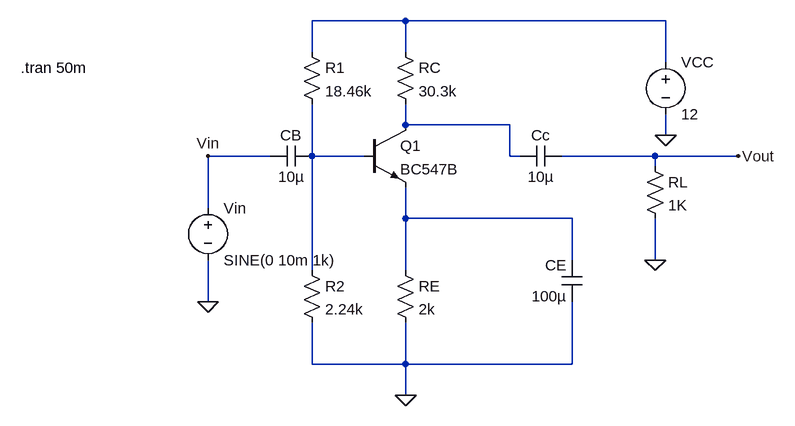
[diagram p0: schematic 4general.asc]
4general.asc, the LTspice schematic file:
Version 4
SHEET 1 880 680
WIRE 240 16 96 16
WIRE 640 16 240 16
WIRE 96 64 96 16
WIRE 240 64 240 16
WIRE 640 80 640 16
WIRE 240 176 240 144
WIRE 400 176 240 176
WIRE 640 192 640 160
WIRE 32 224 -64 224
WIRE 96 224 96 144
WIRE 176 224 96 224
WIRE 400 224 400 176
WIRE 416 224 400 224
WIRE 624 224 480 224
WIRE 752 224 624 224
WIRE 624 240 624 224
WIRE -64 304 -64 224
WIRE 240 320 240 272
WIRE 496 320 240 320
WIRE 496 384 496 320
WIRE 624 384 624 320
WIRE 96 400 96 224
WIRE 240 400 240 320
WIRE -64 448 -64 384
WIRE 96 544 96 480
WIRE 240 544 240 480
WIRE 240 544 96 544
WIRE 496 544 496 448
WIRE 496 544 240 544
WIRE 240 592 240 544
FLAG 640 192 0
FLAG 624 384 0
FLAG 240 592 0
FLAG -64 448 0
FLAG 752 224 Vout
FLAG -64 224 Vin
SYMBOL voltage -64 288 R0
SYMATTR InstName Vin
SYMATTR Value SINE(0 10m 1k)
SYMATTR Value2 AC 1
SYMBOL voltage 640 64 R0
SYMATTR InstName VCC
SYMATTR Value 12
SYMBOL cap 96 208 R90
WINDOW 0 0 32 VBottom 2
WINDOW 3 32 32 VTop 2
SYMATTR InstName CB
SYMATTR Value 10µ
SYMBOL cap 512 448 R180
WINDOW 0 24 56 Left 2
WINDOW 3 24 8 Left 2
SYMATTR InstName CE
SYMATTR Value 100µ
SYMBOL cap 416 240 R270
WINDOW 0 32 32 VTop 2
WINDOW 3 0 32 VBottom 2
SYMATTR InstName Cc
SYMATTR Value 10µ
SYMBOL npn 176 176 R0
SYMATTR InstName Q1
SYMATTR Value BC547B
SYMBOL res 80 384 R0
SYMATTR InstName R2
SYMATTR Value 2.24k
SYMBOL res 80 48 R0
SYMATTR InstName R1
SYMATTR Value 18.46k
SYMBOL res 224 48 R0
SYMATTR InstName RC
SYMATTR Value 30.3k
SYMBOL res 224 384 R0
SYMATTR InstName RE
SYMATTR Value 2k
SYMBOL res 608 224 R0
SYMATTR InstName RL
SYMATTR Value 1K
TEXT -352 88 Left 2 !.tran 50m

The netlist it stands for:
* 4general.asc
Vin Vin 0 SINE(0 10m 1k) AC 1
VCC N001 0 12
CB N003 Vin 10µ
CE 0 N004 100µ
Cc N002 Vout 10µ
Q1 N002 N003 N004 0 BC547B
R2 N003 0 2.24k
R1 N001 N003 18.46k
RC N001 N002 30.3k
RE N004 0 2k
RL Vout 0 1K
.model NPN NPN
.model PNP PNP
.lib standard.bjt
.tran 50m
.backanno
.end